# Altium schematic sheet GPIO.SchDoc
size A4
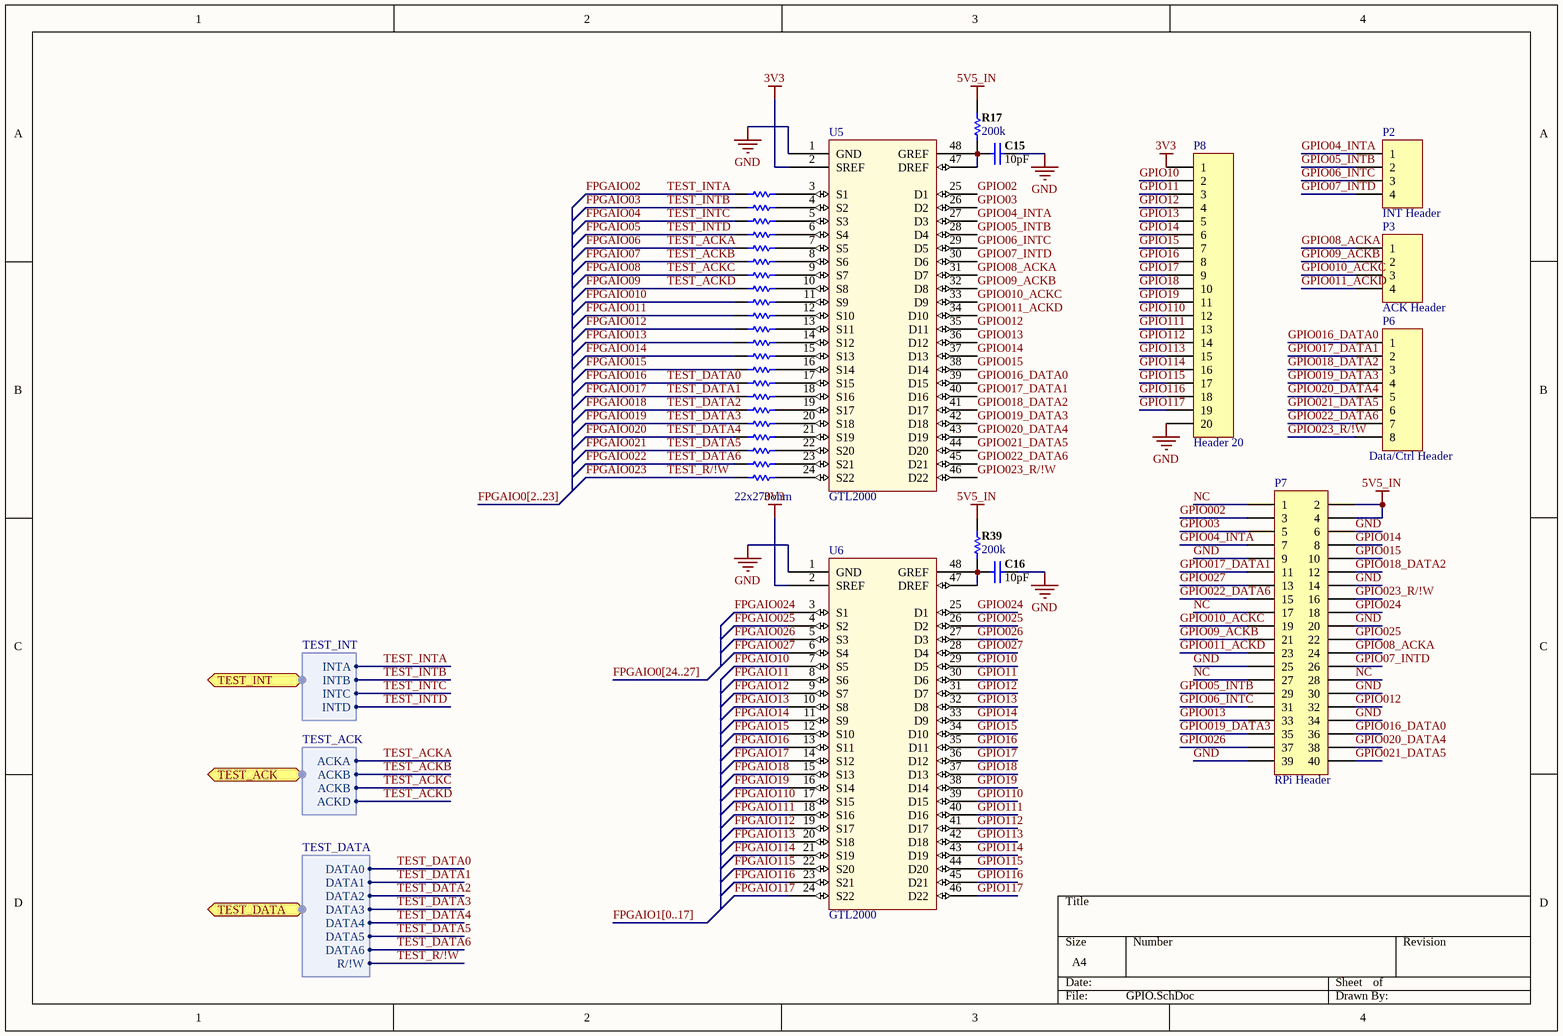
[diagram p0: GPIO.SchDoc]

## Parts
C15  10pF  [0805C-GENERIC]
C16  10pF  [0805C-GENERIC]
P2  INT Header  [HEADER-1X4]
P3  ACK Header  [HEADER-1X4]
P6  Data/Ctrl Header  [HEADER-1X8]
P7  RPi Header  [HDR2X20]
P8  Header 20  [HDR1X20]
R3  (no value)  [6-0805_M]
R6  (no value)  [6-0805_M]
R8  (no value)  [6-0805_M]
R17  value 200k  [6-0805_M]
R19  (no value)  [6-0805_M]
R20  (no value)  [6-0805_M]
R21  (no value)  [6-0805_M]
R22  (no value)  [6-0805_M]
R23  (no value)  [6-0805_M]
R24  (no value)  [6-0805_M]
R25  (no value)  [6-0805_M]
R26  (no value)  [6-0805_M]
R28  (no value)  [6-0805_M]
R29  (no value)  [6-0805_M]
R30  (no value)  [6-0805_M]
R31  (no value)  [6-0805_M]
R32  (no value)  [6-0805_M]
R33  (no value)  [6-0805_M]
R34  (no value)  [6-0805_M]
R35  (no value)  [6-0805_M]
R36  (no value)  [6-0805_M]
R37  (no value)  [6-0805_M]
R38  (no value)  [6-0805_M]
R39  value 200k  [6-0805_M]
U5  GTL2000  [TSSOP50P810X120-48N]
U6  GTL2000  [TSSOP50P810X120-48N]

## Ports
TEST_ACK (harness TEST_ACK), TEST_DATA (harness TEST_DATA), TEST_INT (harness TEST_INT)

## Harnesses
TEST_INT: INTA, INTB, INTC, INTD
TEST_ACK: ACKA, ACKB, ACKB, ACKD
TEST_DATA: DATA0, DATA1, DATA2, DATA3, DATA4, DATA5, DATA6, R/!W

## Nets
3V3: P8.1 U5.2(SREF) U6.2(SREF)
5V5_IN: P7.2 P7.4 R17.2 R39.2
GND: C15.2 C16.2 P7.6 P7.9 P7.14 P7.20 P7.25 P7.30 P7.34 P7.39 P8.20 U5.1(GND) U6.1(GND)
FPGAIO02: R19.1 ; port TEST_INT.INTA  [also labelled TEST_INTA]
FPGAIO03: R3.1 ; port TEST_INT.INTB  [also labelled TEST_INTB]
FPGAIO04: R20.1 ; port TEST_INT.INTC  [also labelled TEST_INTC]
FPGAIO05: R21.1 ; port TEST_INT.INTD  [also labelled TEST_INTD]
FPGAIO06: R22.1 ; port TEST_ACK.ACKA  [also labelled TEST_ACKA]
FPGAIO07: R6.1 R8.1 ; port TEST_ACK.ACKB  [also labelled FPGAIO08, TEST_ACKB, TEST_ACKC]
FPGAIO09: R26.1 ; port TEST_ACK.ACKD  [also labelled TEST_ACKD]
FPGAIO010: R28.1
FPGAIO10: U6.7(S5)
FPGAIO011: R23.1
FPGAIO11: U6.8(S6)
FPGAIO012: R29.1
FPGAIO12: U6.9(S7)
FPGAIO013: R30.1
FPGAIO13: U6.10(S8)
FPGAIO014: R31.1
FPGAIO14: U6.11(S9)
FPGAIO015: R32.1
FPGAIO15: U6.12(S10)
FPGAIO016: R33.1 ; harness TEST_DATA.DATA0  [also labelled TEST_DATA0]
FPGAIO16: U6.13(S11)
FPGAIO017: R34.1 ; harness TEST_DATA.DATA1  [also labelled TEST_DATA1]
FPGAIO17: U6.14(S12)
FPGAIO018: R35.1 ; harness TEST_DATA.DATA2  [also labelled TEST_DATA2]
FPGAIO18: U6.15(S13)
FPGAIO019: R36.1 ; harness TEST_DATA.DATA3  [also labelled TEST_DATA3]
FPGAIO19: U6.16(S14)
FPGAIO020: R37.1 ; harness TEST_DATA.DATA4  [also labelled TEST_DATA4]
FPGAIO021: R24.1 ; harness TEST_DATA.DATA5  [also labelled TEST_DATA5]
FPGAIO022: R25.1 ; harness TEST_DATA.DATA6  [also labelled TEST_DATA6]
FPGAIO023: R38.1 ; harness TEST_DATA.R/!W  [also labelled TEST_R/!W]
FPGAIO024: U6.3(S1)
FPGAIO025: U6.4(S2)
FPGAIO026: U6.5(S3)
FPGAIO027: U6.6(S4)
FPGAIO110: U6.17(S15)
FPGAIO111: U6.18(S16)
FPGAIO112: U6.19(S17)
FPGAIO113: U6.20(S18)
FPGAIO114: U6.21(S19)
FPGAIO115: U6.22(S20)
FPGAIO116: U6.23(S21)
FPGAIO117: U6.24(S22)
GPIO02: U5.25(D1)
GPIO002: P7.3
GPIO03: P7.5 U5.26(D2)
GPIO04_INTA: P2.1 P7.7 U5.27(D3)
GPIO05_INTB: P2.2 P7.29 U5.28(D4)
GPIO06_INTC: P2.3 P7.31 U5.29(D5)
GPIO07_INTD: P2.4 P7.26 U5.30(D6)
GPIO08_ACKA: P3.1 P7.24 U5.31(D7)
GPIO09_ACKB: P3.2 P7.21 U5.32(D8)
GPIO10: P8.2 U6.29(D5)
GPIO010_ACKC: P3.3 P7.19 U5.33(D9)
GPIO11: P8.3 U6.30(D6)
GPIO011_ACKD: P3.4 P7.23 U5.34(D10)
GPIO012: P7.32 U5.35(D11)
GPIO12: P8.4 U6.31(D7)
GPIO013: P7.33 U5.36(D12)
GPIO13: P8.5 U6.32(D8)
GPIO014: P7.8 U5.37(D13)
GPIO14: P8.6 U6.33(D9)
GPIO015: P7.10 U5.38(D14)
GPIO15: P8.7 U6.34(D10)
GPIO16: P8.8 U6.35(D11)
GPIO016_DATA0: P6.1 P7.36 U5.39(D15)
GPIO17: P8.9 U6.36(D12)
GPIO017_DATA1: P6.2 P7.11 U5.40(D16)
GPIO18: P8.10 U6.37(D13)
GPIO018_DATA2: P6.3 P7.12 U5.41(D17)
GPIO19: P8.11 U6.38(D14)
GPIO019_DATA3: P6.4 P7.35 U5.42(D18)
GPIO020_DATA4: P6.5 P7.38 U5.43(D19)
GPIO021_DATA5: P6.6 P7.40 U5.44(D20)
GPIO022_DATA6: P6.7 P7.15 U5.45(D21)
GPIO023_R/!W: P6.8 P7.16 U5.46(D22)
GPIO024: P7.18 U6.25(D1)
GPIO025: P7.22 U6.26(D2)
GPIO026: P7.37 U6.27(D3)
GPIO027: P7.13 U6.28(D4)
GPIO110: P8.12 U6.39(D15)
GPIO111: P8.13 U6.40(D16)
GPIO112: P8.14 U6.41(D17)
GPIO113: P8.15 U6.42(D18)
GPIO114: P8.16 U6.43(D19)
GPIO115: P8.17 U6.44(D20)
GPIO116: P8.18 U6.45(D21)
GPIO117: P8.19 U6.46(D22)
NC: P7.1 P7.17 P7.27 P7.28
NetC15_1: C15.1 R17.1 U5.47(DREF) U5.48(GREF)
NetC16_1: C16.1 R39.1 U6.47(DREF) U6.48(GREF)
NetR3_2: R3.2 U5.4(S2)
NetR6_2: R6.2 U5.8(S6)
NetR8_2: R8.2 U5.9(S7)
NetR19_2: R19.2 U5.3(S1)
NetR20_2: R20.2 U5.5(S3)
NetR21_2: R21.2 U5.6(S4)
NetR22_2: R22.2 U5.7(S5)
NetR23_2: R23.2 U5.12(S10)
NetR24_2: R24.2 U5.22(S20)
NetR25_2: R25.2 U5.23(S21)
NetR26_2: R26.2 U5.10(S8)
NetR28_2: R28.2 U5.11(S9)
NetR29_2: R29.2 U5.13(S11)
NetR30_2: R30.2 U5.14(S12)
NetR31_2: R31.2 U5.15(S13)
NetR32_2: R32.2 U5.16(S14)
NetR33_2: R33.2 U5.17(S15)
NetR34_2: R34.2 U5.18(S16)
NetR35_2: R35.2 U5.19(S17)
NetR36_2: R36.2 U5.20(S18)
NetR37_2: R37.2 U5.21(S19)
NetR38_2: R38.2 U5.24(S22)

## Buses and harness runs
bus FPGAIO0[2..23]
bus FPGAIO0[24..27]
bus FPGAIO1[0..17]

## Notes on the sheet
- (near R38) 22x270ohm

## Library data of the parts
C15 C16 = D-101-0027: Capacitor, Ceramic, 1uF 10% 25V 1206 (3216) X7R; Polarity: Non-Polarized; Rated Voltage: 10 V; Capacitance: 10pF; Dielectric: X7R; Mounting Technology: Surface Mount; Status: Production; Technology: Ceramic; Tolerance: 10 %; Category: Capacitor
P2 P3 = Header 4: Header, 4-Pin; LatestRevisionDate: 17-Jul-2002; LatestRevisionNote: Re-released for DXP Platform.; Publisher: Altium Limited
P6 = Header 8: Header, 8-Pin; LatestRevisionDate: 17-Jul-2002; LatestRevisionNote: Re-released for DXP Platform.; Publisher: Altium Limited
P7 = Header 20X2: Header, 20-Pin, Dual row; LatestRevisionDate: 17-Jul-2002; LatestRevisionNote: Re-released for DXP Platform.; Publisher: Altium Limited
P8 = Header 20: Header, 20-Pin; LatestRevisionDate: 17-Jul-2002; LatestRevisionNote: Re-released for DXP Platform.; Publisher: Altium Limited
R3 R6 R8 R19-R26 R28-R38 = D-100-0116: Tolerance: 1 %; Value: 270; Mounting Technology: Surface Mount; Status: Production; Category: Resistor
R17 R39 = D-100-0116: Tolerance: 1 %; Mounting Technology: Surface Mount; Status: Production; Category: Resistor
U5 U6 = GTL2000: 22-bit bi-directional low voltage translator